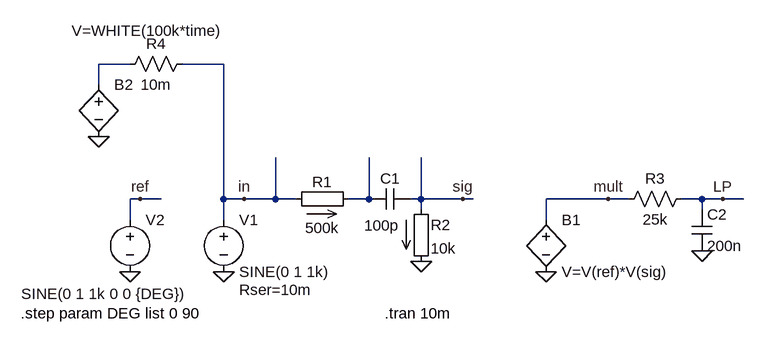
[diagram p0: schematic Lock-in.asc]
Lock-in.asc, the LTspice schematic file:
Version 4
SHEET 1 880 680
WIRE -352 -144 -400 -144
WIRE -208 -144 -272 -144
WIRE -400 -112 -400 -144
WIRE -336 64 -352 64
WIRE -304 64 -336 64
WIRE -208 64 -208 -144
WIRE -176 64 -208 64
WIRE -128 64 -128 0
WIRE -128 64 -176 64
WIRE -96 64 -128 64
WIRE 16 64 16 0
WIRE 16 64 -16 64
WIRE 96 64 96 0
WIRE 96 64 80 64
WIRE 160 64 96 64
WIRE 176 64 160 64
WIRE 384 64 288 64
WIRE 416 64 384 64
WIRE 528 64 496 64
WIRE 560 64 528 64
WIRE 592 64 560 64
WIRE 96 80 96 64
WIRE 528 80 528 64
WIRE -352 96 -352 64
WIRE -208 96 -208 64
WIRE 288 96 288 64
FLAG 288 176 0
FLAG -208 176 0
FLAG -176 64 in
FLAG 384 64 mult
FLAG 160 64 sig
FLAG 96 160 0
FLAG -352 176 0
FLAG -336 64 ref
FLAG 528 144 0
FLAG 560 64 LP
FLAG -400 -32 0
SYMBOL bv 288 80 R0
SYMATTR InstName B1
SYMATTR Value V=V(ref)*V(sig)
SYMBOL voltage -208 80 R0
WINDOW 123 0 0 Left 0
WINDOW 39 24 124 Left 2
SYMATTR SpiceLine Rser=10m
SYMATTR InstName V1
SYMATTR Value SINE(0 1 1k)
SYMBOL cap 80 48 R90
WINDOW 0 0 32 VBottom 2
WINDOW 3 41 45 VTop 2
SYMATTR InstName C1
SYMATTR Value 100p
SYMBOL _Res_I -112 80 R270
WINDOW 0 27 56 VTop 2
WINDOW 3 -13 56 VBottom 2
SYMATTR InstName R1
SYMATTR Value 500k
SYMBOL _Res_I 80 64 R0
SYMATTR InstName R2
SYMATTR Value 10k
SYMBOL voltage -352 80 R0
WINDOW 3 -167 130 Left 2
WINDOW 123 0 0 Left 0
WINDOW 39 0 0 Left 0
SYMATTR Value SINE(0 1 1k 0 0 {DEG})
SYMATTR InstName V2
SYMBOL res 512 48 R90
WINDOW 0 0 56 VBottom 2
WINDOW 3 32 56 VTop 2
SYMATTR InstName R3
SYMATTR Value 25k
SYMBOL cap 512 80 R0
SYMATTR InstName C2
SYMATTR Value 200n
SYMBOL bv -400 -128 R0
WINDOW 3 -42 -67 Left 2
SYMATTR Value V=WHITE(100k*time)
SYMATTR InstName B2
SYMBOL res -256 -160 R90
WINDOW 0 0 56 VBottom 2
WINDOW 3 32 56 VTop 2
SYMATTR InstName R4
SYMATTR Value 10m
TEXT 40 240 Left 2 !.tran 10m
TEXT -520 240 Left 2 !.step param DEG list 0 90

The netlist it stands for:
* Lock-in.asc
B1 mult 0 V=V(ref)*V(sig)
V1 in 0 SINE(0 1 1k) Rser=10m
C1 sig N002 100p
R1 in N002 500k
R2 sig 0 10k
V2 ref 0 SINE(0 1 1k 0 0 {DEG})
R3 LP mult 25k
C2 LP 0 200n
B2 N001 0 V=WHITE(100k*time)
R4 in N001 10m
.tran 10m
.step param DEG list 0 90
.backanno
.end